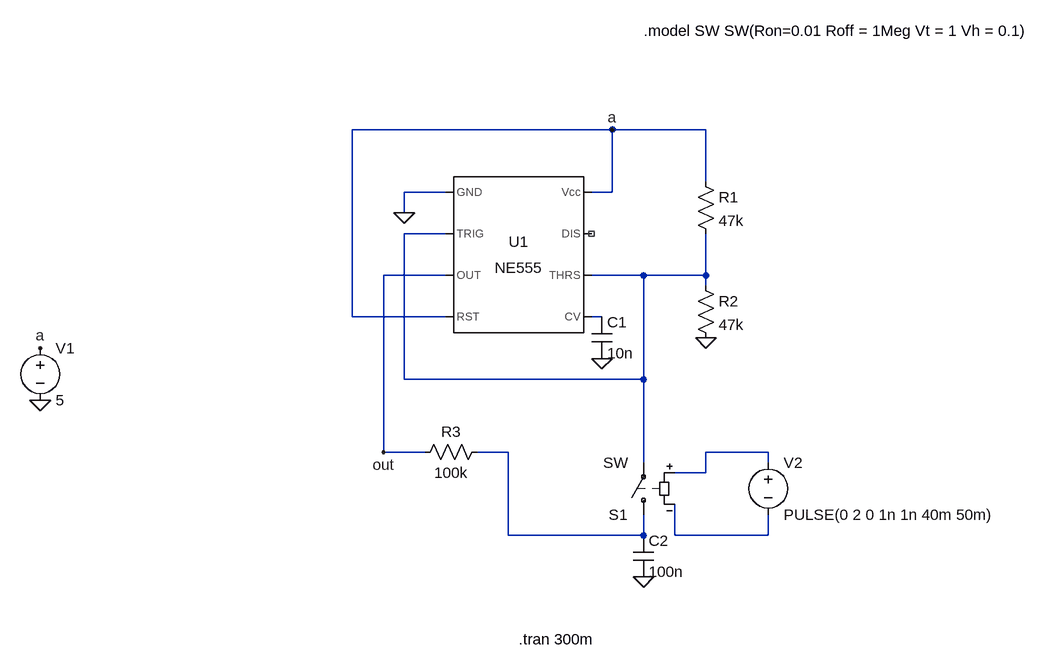
[diagram p0: schematic bistable 555.asc]
bistable 555.asc, the LTspice schematic file:
Version 4
SHEET 1 1024 680
WIRE 336 -176 -64 -176
WIRE 480 -176 336 -176
WIRE 480 -96 480 -176
WIRE 80 -80 16 -80
WIRE 336 -80 336 -176
WIRE 336 -80 304 -80
WIRE 16 -48 16 -80
WIRE 80 -16 16 -16
WIRE 80 48 -16 48
WIRE 384 48 304 48
WIRE 480 48 480 -16
WIRE 480 48 384 48
WIRE 480 64 480 48
WIRE -64 112 -64 -176
WIRE 80 112 -64 112
WIRE 320 112 304 112
WIRE 16 208 16 -16
WIRE 384 208 384 48
WIRE 384 208 16 208
WIRE -16 320 -16 48
WIRE 48 320 -16 320
WIRE 176 320 128 320
WIRE 576 320 480 320
WIRE 384 336 384 208
WIRE 576 336 576 320
WIRE 480 352 480 320
WIRE 480 352 432 352
WIRE 176 448 176 320
WIRE 384 448 384 416
WIRE 384 448 176 448
WIRE 432 448 432 400
WIRE 576 448 576 416
WIRE 576 448 432 448
FLAG 16 -48 0
FLAG 480 144 0
FLAG 320 176 0
FLAG 384 512 0
FLAG -544 240 0
FLAG -544 160 a
FLAG 336 -176 a
FLAG -16 320 out
SYMBOL Misc\\NE555 192 16 R0
SYMATTR InstName U1
SYMBOL res 464 -112 R0
SYMATTR InstName R1
SYMATTR Value 47k
SYMBOL res 464 48 R0
SYMATTR InstName R2
SYMATTR Value 47k
SYMBOL cap 304 112 R0
SYMATTR InstName C1
SYMATTR Value 10n
SYMBOL sw 384 432 R180
SYMATTR InstName S1
SYMBOL cap 368 448 R0
SYMATTR InstName C2
SYMATTR Value 100n
SYMBOL res 144 304 R90
WINDOW 0 0 56 VBottom 2
WINDOW 3 32 56 VTop 2
SYMATTR InstName R3
SYMATTR Value 100k
SYMBOL voltage -544 144 R0
WINDOW 123 0 0 Left 0
WINDOW 39 0 0 Left 0
SYMATTR InstName V1
SYMATTR Value 5
SYMBOL voltage 576 320 R0
WINDOW 123 0 0 Left 0
WINDOW 39 0 0 Left 0
SYMATTR InstName V2
SYMATTR Value PULSE(0 2 0 1n 1n 40m 50m)
TEXT 192 608 Left 2 !.tran 300m
TEXT 384 -328 Left 2 !.model SW SW(Ron=0.01 Roff = 1Meg Vt = 1 Vh = 0.1)

The netlist it stands for:
* bistable 555.asc
XU1 0 N001 out a N002 N001 NC_01 a NE555  ; pins GND TRIG OUT RST CV THRS DIS Vcc
R1 a N001 47k
R2 N001 0 47k
C1 N002 0 10n
S1 N003 N001 N004 N005 SW
C2 N003 0 100n
R3 N003 out 100k
V1 a 0 5
V2 N004 N005 PULSE(0 2 0 1n 1n 40m 50m)
.tran 300m
.model SW SW(Ron=0.01 Roff = 1Meg Vt = 1 Vh = 0.1)
.lib NE555.sub
.backanno
.end